# Altium project HW_Z-BAND_SMART_AMP_R1.PrjPcb (part 4 of 4)

## Sheet 10_RF_2.SchDoc: =TitleParameter
size A2; Date: 6/12/2026; ApprovedBy: U.KAYACIK; CheckedBy: E. CAGLAV; DrawnBy: E. CAGLAV; Revision: R1; SheetNumber: 12; SheetTotal: 12
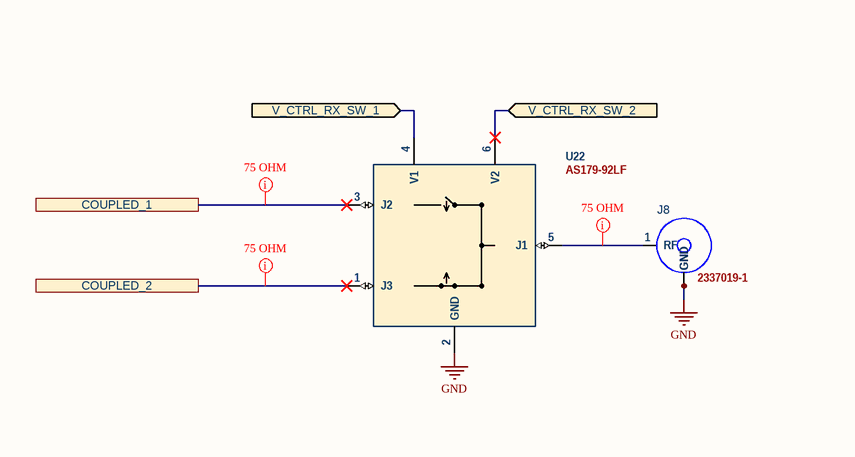
[diagram p11: 10_RF_2.SchDoc, left]
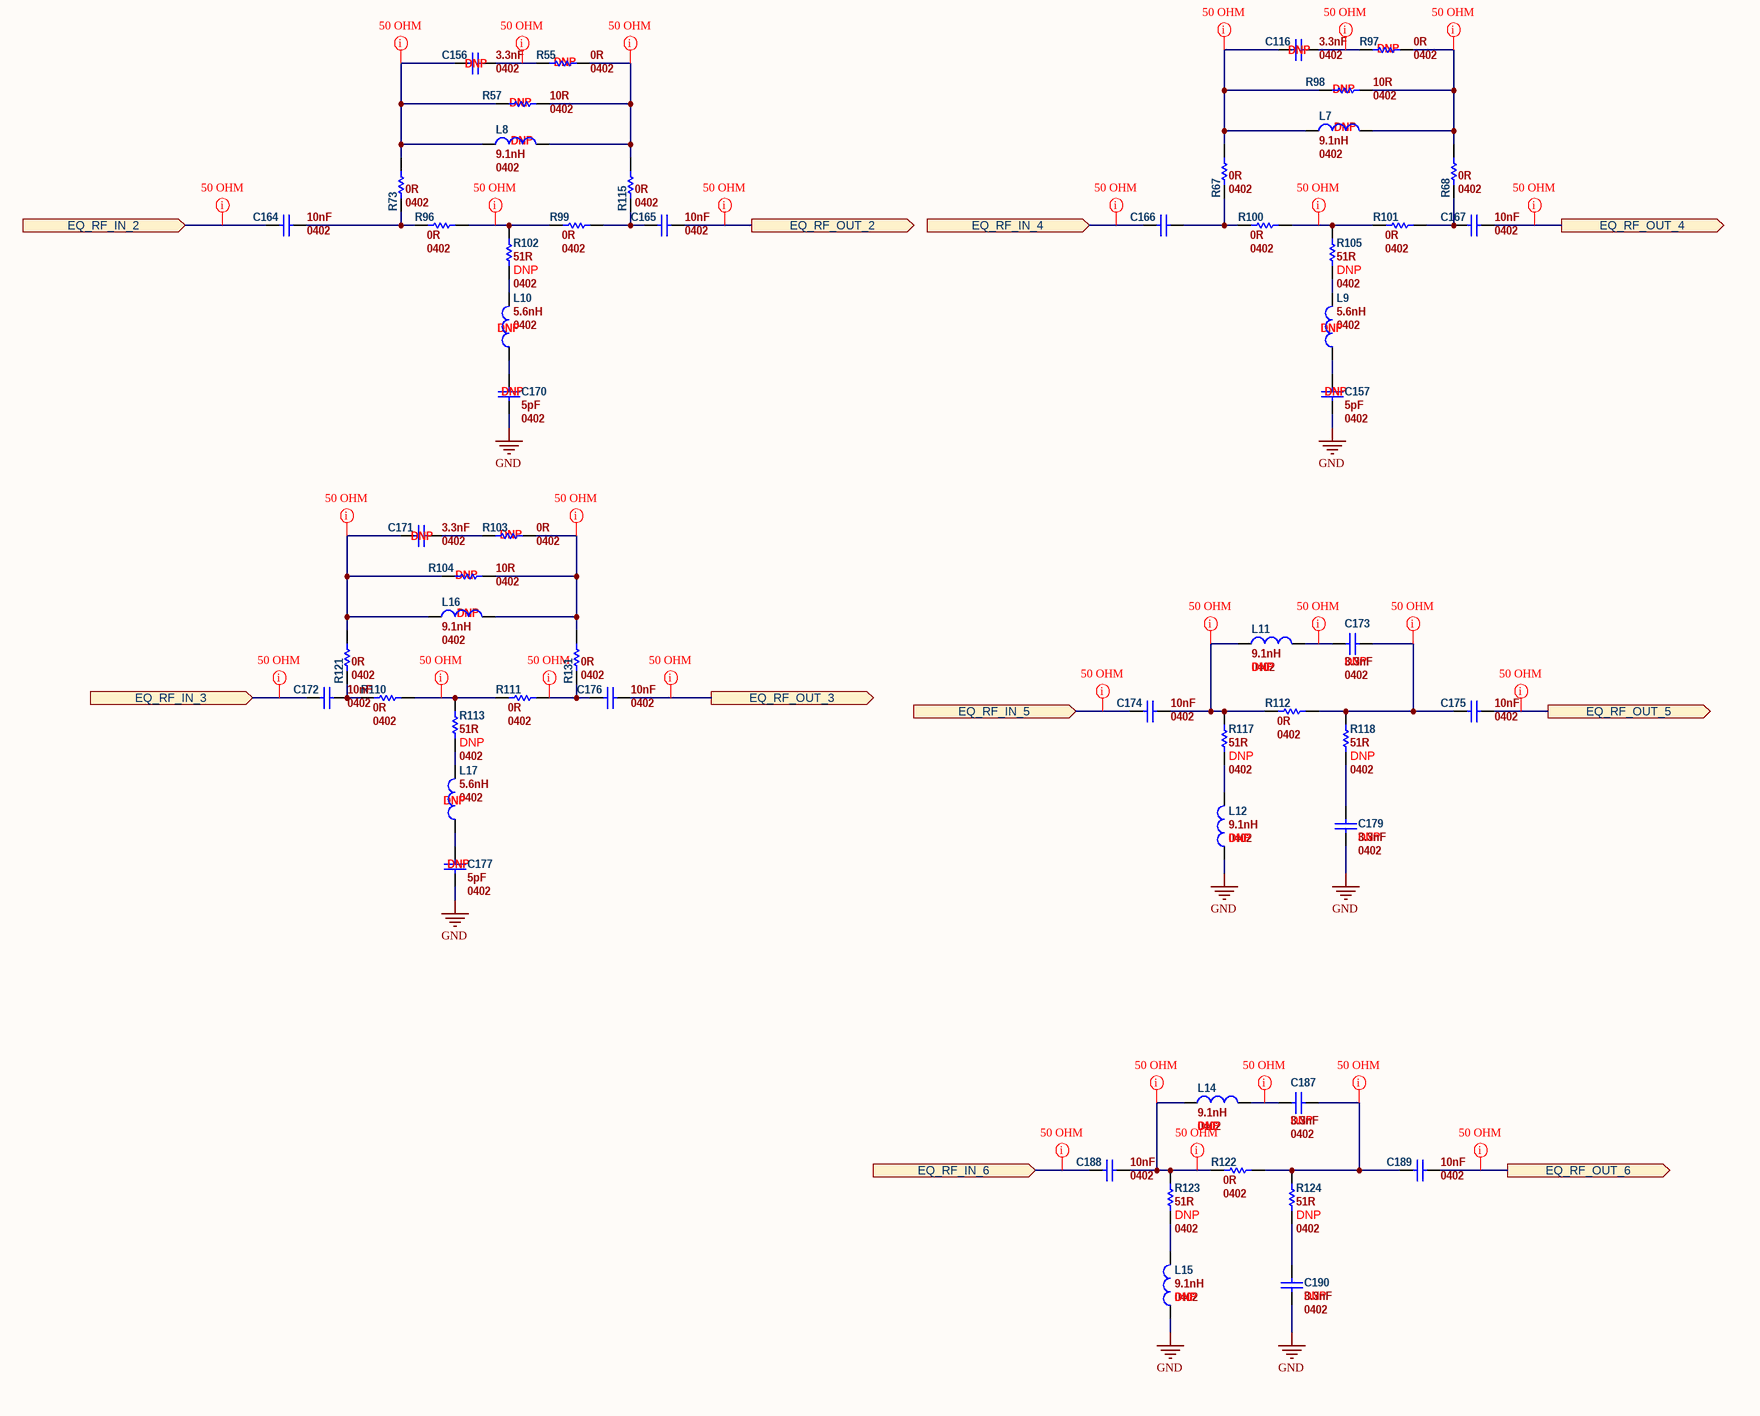
[diagram p12: 10_RF_2.SchDoc, right]

### Parts
C116  value 3.3nF  Assembly: DNP  Package: 0402  [CAP_0402_N]  (hidden comment: C 0402 50V X7R - 3.3nF)
C156  value 3.3nF  Assembly: DNP  Package: 0402  [CAP_0402_N]  (hidden comment: C 0402 50V X7R - 3.3nF)
C157  value 5pF  Assembly: DNP  Package: 0402  [CAP_0402_N]  (hidden comment: C 0402 50V C0G/NP0 - 5pF)
C164  value 10nF  Package: 0402  [CAP_0402_N]  (hidden comment: C 0402 50V X7R - 10nF)
C165  value 10nF  Package: 0402  [CAP_0402_N]  (hidden comment: C 0402 50V X7R - 10nF)
C166  C 0402 50V X7R - 10nF  [CAP_0402_N]  (value not drawn)
C167  value 10nF  Package: 0402  [CAP_0402_N]  (hidden comment: C 0402 50V X7R - 10nF)
C170  value 5pF  Assembly: DNP  Package: 0402  [CAP_0402_N]  (hidden comment: C 0402 50V C0G/NP0 - 5pF)
C171  value 3.3nF  Assembly: DNP  Package: 0402  [CAP_0402_N]  (hidden comment: C 0402 50V X7R - 3.3nF)
C172  value 10nF  Package: 0402  [CAP_0402_N]  (hidden comment: C 0402 50V X7R - 10nF)
C173  value 3.3nF  Assembly: DNP  Package: 0402  [CAP_0402_N]  (hidden comment: C 0402 50V X7R - 3.3nF)
C174  value 10nF  Package: 0402  [CAP_0402_N]  (hidden comment: C 0402 50V X7R - 10nF)
C175  value 10nF  Package: 0402  [CAP_0402_N]  (hidden comment: C 0402 50V X7R - 10nF)
C176  value 10nF  Package: 0402  [CAP_0402_N]  (hidden comment: C 0402 50V X7R - 10nF)
C177  value 5pF  Assembly: DNP  Package: 0402  [CAP_0402_N]  (hidden comment: C 0402 50V C0G/NP0 - 5pF)
C179  value 3.3nF  Assembly: DNP  Package: 0402  [CAP_0402_N]  (hidden comment: C 0402 50V X7R - 3.3nF)
C187  value 3.3nF  Assembly: DNP  Package: 0402  [CAP_0402_N]  (hidden comment: C 0402 50V X7R - 3.3nF)
C188  value 10nF  Package: 0402  [CAP_0402_N]  (hidden comment: C 0402 50V X7R - 10nF)
C189  value 10nF  Package: 0402  [CAP_0402_N]  (hidden comment: C 0402 50V X7R - 10nF)
C190  value 3.3nF  Assembly: DNP  Package: 0402  [CAP_0402_N]  (hidden comment: C 0402 50V X7R - 3.3nF)
J8  2337019-1  [2337019-1]
L7  value 9.1nH  Package: 0402  Assembly: DNP  [IND_0402_N]  (hidden comment: L 0402 500mA - 9.1nH)
L8  value 9.1nH  Package: 0402  Assembly: DNP  [IND_0402_N]  (hidden comment: L 0402 500mA - 9.1nH)
L9  value 5.6nH  Package: 0402  Assembly: DNP  [IND_0402_N]  (hidden comment: L 0402 650mA - 5.6nH)
L10  value 5.6nH  Package: 0402  Assembly: DNP  [IND_0402_N]  (hidden comment: L 0402 650mA - 5.6nH)
L11  value 9.1nH  Package: 0402  Assembly: DNP  [IND_0402_N]  (hidden comment: L 0402 500mA - 9.1nH)
L12  value 9.1nH  Package: 0402  Assembly: DNP  [IND_0402_N]  (hidden comment: L 0402 500mA - 9.1nH)
L14  value 9.1nH  Package: 0402  Assembly: DNP  [IND_0402_N]  (hidden comment: L 0402 500mA - 9.1nH)
L15  value 9.1nH  Package: 0402  Assembly: DNP  [IND_0402_N]  (hidden comment: L 0402 500mA - 9.1nH)
L16  value 9.1nH  Package: 0402  Assembly: DNP  [IND_0402_N]  (hidden comment: L 0402 500mA - 9.1nH)
L17  value 5.6nH  Package: 0402  Assembly: DNP  [IND_0402_N]  (hidden comment: L 0402 650mA - 5.6nH)
R55  value 0R  Assembly: DNP  Package: 0402  [RES_0402_N]  (hidden comment: R 0402 1/10W - 0R)
R57  value 10R  Assembly: DNP  Package: 0402  [RES_0402_N]  (hidden comment: R 0402 1/10W 1% - 10R)
R67  value 0R  Package: 0402  [RES_0402_N]  (hidden comment: R 0402 1/10W - 0R)
R68  value 0R  Package: 0402  [RES_0402_N]  (hidden comment: R 0402 1/10W - 0R)
R73  value 0R  Package: 0402  [RES_0402_N]  (hidden comment: R 0402 1/10W - 0R)
R96  value 0R  Package: 0402  [RES_0402_N]  (hidden comment: R 0402 1/10W - 0R)
R97  value 0R  Assembly: DNP  Package: 0402  [RES_0402_N]  (hidden comment: R 0402 1/10W - 0R)
R98  value 10R  Assembly: DNP  Package: 0402  [RES_0402_N]  (hidden comment: R 0402 1/10W 1% - 10R)
R99  value 0R  Package: 0402  [RES_0402_N]  (hidden comment: R 0402 1/10W - 0R)
R100  value 0R  Package: 0402  [RES_0402_N]  (hidden comment: R 0402 1/10W - 0R)
R101  value 0R  Package: 0402  [RES_0402_N]  (hidden comment: R 0402 1/10W - 0R)
R102  value 51R  Assembly: DNP  Package: 0402  [RES_0402_N]  (hidden comment: R 0402 1/10W 1% - 51R)
R103  value 0R  Assembly: DNP  Package: 0402  [RES_0402_N]  (hidden comment: R 0402 1/10W - 0R)
R104  value 10R  Assembly: DNP  Package: 0402  [RES_0402_N]  (hidden comment: R 0402 1/10W 1% - 10R)
R105  value 51R  Assembly: DNP  Package: 0402  [RES_0402_N]  (hidden comment: R 0402 1/10W 1% - 51R)
R110  value 0R  Package: 0402  [RES_0402_N]  (hidden comment: R 0402 1/10W - 0R)
R111  value 0R  Package: 0402  [RES_0402_N]  (hidden comment: R 0402 1/10W - 0R)
R112  value 0R  Package: 0402  [RES_0402_N]  (hidden comment: R 0402 1/10W - 0R)
R113  value 51R  Assembly: DNP  Package: 0402  [RES_0402_N]  (hidden comment: R 0402 1/10W 1% - 51R)
R115  value 0R  Package: 0402  [RES_0402_N]  (hidden comment: R 0402 1/10W - 0R)
R117  value 51R  Assembly: DNP  Package: 0402  [RES_0402_N]  (hidden comment: R 0402 1/10W 1% - 51R)
R118  value 51R  Assembly: DNP  Package: 0402  [RES_0402_N]  (hidden comment: R 0402 1/10W 1% - 51R)
R121  value 0R  Package: 0402  [RES_0402_N]  (hidden comment: R 0402 1/10W - 0R)
R122  value 0R  Package: 0402  [RES_0402_N]  (hidden comment: R 0402 1/10W - 0R)
R123  value 51R  Assembly: DNP  Package: 0402  [RES_0402_N]  (hidden comment: R 0402 1/10W 1% - 51R)
R124  value 51R  Assembly: DNP  Package: 0402  [RES_0402_N]  (hidden comment: R 0402 1/10W 1% - 51R)
R131  value 0R  Package: 0402  [RES_0402_N]  (hidden comment: R 0402 1/10W - 0R)
U22  AS179-92LF  [SC70_SOT-363]

### Ports
COUPLED_1, COUPLED_2, EQ_RF_IN_2 (in), EQ_RF_IN_3 (in), EQ_RF_IN_4 (in), EQ_RF_IN_5 (in), EQ_RF_IN_6 (in), EQ_RF_OUT_2 (out), EQ_RF_OUT_3 (out), EQ_RF_OUT_4 (out), EQ_RF_OUT_5 (out), EQ_RF_OUT_6 (out), V_CTRL_RX_SW_1 (in), V_CTRL_RX_SW_2 (in)

### Nets
GND: C157.1 C170.1 C177.1 C179.1 C190.1 J8.G1(GND) J8.G2(GND) L12.1 L15.1 U22.2(GND)
NetC116_1: C116.1 L7.1 R67.2 R98.1
NetC116_2: C116.2 R97.1
NetC156_1: C156.1 L8.1 R57.1 R73.2
NetC156_2: C156.2 R55.1
NetC157_2: C157.2 L9.1
NetC164_1: C164.1 ; port EQ_RF_IN_2
NetC164_2: C164.2 R73.1 R96.1
NetC165_1: C165.1 R99.2 R115.1
NetC165_2: C165.2 ; port EQ_RF_OUT_2
NetC166_1: C166.1 ; port EQ_RF_IN_4
NetC166_2: C166.2 R67.1 R100.1
NetC167_1: C167.1 R68.1 R101.2
NetC167_2: C167.2 ; port EQ_RF_OUT_4
NetC170_2: C170.2 L10.1
NetC171_1: C171.1 L16.1 R104.1 R121.2
NetC171_2: C171.2 R103.1
NetC172_1: C172.1 ; port EQ_RF_IN_3
NetC172_2: C172.2 R110.1 R121.1
NetC173_1: C173.1 C175.1 R112.2 R118.2
NetC173_2: C173.2 L11.2
NetC174_1: C174.1 ; port EQ_RF_IN_5
NetC174_2: C174.2 L11.1 R112.1 R117.2
NetC175_2: C175.2 ; port EQ_RF_OUT_5
NetC176_1: C176.1 R111.2 R131.1
NetC176_2: C176.2 ; port EQ_RF_OUT_3
NetC177_2: C177.2 L17.1
NetC179_2: C179.2 R118.1
NetC187_1: C187.1 C189.1 R122.2 R124.2
NetC187_2: C187.2 L14.2
NetC188_1: C188.1 ; port EQ_RF_IN_6
NetC188_2: C188.2 L14.1 R122.1 R123.2
NetC189_2: C189.2 ; port EQ_RF_OUT_6
NetC190_2: C190.2 R124.1
NetJ8_1: J8.1(RF) U22.5(J1)
NetL7_2: L7.2 R68.2 R97.2 R98.2
NetL8_2: L8.2 R55.2 R57.2 R115.2
NetL9_2: L9.2 R105.1
NetL10_2: L10.2 R102.1
NetL12_2: L12.2 R117.1
NetL15_2: L15.2 R123.1
NetL16_2: L16.2 R103.2 R104.2 R131.2
NetL17_2: L17.2 R113.1
NetR96_2: R96.2 R99.1 R102.2
NetR100_2: R100.2 R101.1 R105.2
NetR110_2: R110.2 R111.1 R113.2
NetU4_26: U22.4(V1) ; port V_CTRL_RX_SW_1
NetU4_27: U22.6(V2) ; port V_CTRL_RX_SW_2
NetU5_1: U22.3(J2) ; port COUPLED_1
NetU19_1: U22.1(J3) ; port COUPLED_2

### Layout directives
net class RF_50_OHM; rule Width Constraint [Pref Impedance = 50.00ohms    Min Impedance = 50.00ohms    Max Impedance = 50.00ohms]: NetC116_1, NetC116_2, NetC156_1, NetC156_2, NetC164_1, NetC165_2, NetC166_1, NetC167_2, NetC171_1, NetC172_1, NetC173_1, NetC173_2, NetC174_1, NetC174_2, NetC175_2, NetC176_1, NetC176_2, NetC187_1, NetC187_2, NetC188_1, NetC188_2, NetC189_2, NetL7_2, NetL8_2, NetL16_2, NetR96_2, NetR100_2, NetR110_2
net class RF_75_OHM; rule Width Constraint [Pref Impedance = 50.00ohms    Min Impedance = 50.00ohms    Max Impedance = 50.00ohms]: NetJ8_1, NetU5_1, NetU19_1

### Notes on the sheet
- Proje/Project:
- Sayfa Adı/Document Name:
- Çizilme Tarihi/Drawing Date
- Son Güncelleme/Last Edit Date
- E. CAGLAV
- Tasarlayan/Designed By
- Kontrol eden/Checked By
- Boyut/Size:
- Sayfa/Sheet:
- Revision:
- A3
- of
- Onaylayan/Approved By
- Varyant/Variant:
- Dil/Language:
- ENG

### Library data of the parts
C116 C156 C171 C173 C179 C187 C190 = C 0402 50V X7R - 3.3nF: CAP CER 3.3nF 50V X7R 0402 ±5%; Manufacturer 1: MURATA ELECTRONICS; Manufacturer Part Number 1: GRM155R71H332JA01D; Location: NA; MSL Level: Level-1; MaxHeight_mm: 0.55; M_Number_of_Pins: 2; Check: Approved; UnitPrice: 0.1; PackageType: SMD; Tolerance: ±5%; ComponentLink2Description: Datasheet; Status: Active; ComponentLink3Description: DigiKey; ComponentLink3URL: https://www.digikey.com/en/products/detail/murata-electronics/GRM155R71H332JA01D/5251319?utm_adgroup=&utm_source=google&utm_medium=cpc&utm_campaign=Pmax_Product_All%20Products&utm_term=&utm_content=&utm_id=go_cmp-18790247214_adg-_ad-__dev-c_ext-_prd-_sig-EAIaIQobChMI-qDC4avGhQMVhkVBAh32KAqJEAAYAiAAEgIqzvD_BwE&gad_source=1&gclid=EAIaIQobChMI-qDC4avGhQMVhkVBAh32KAqJEAAYAiAAEgIqzvD_BwE; M_AmpersPerContact: NA; M_Duty Cycle(%): NA; M_MatingCycle: NA; M_Number_of_Bits(K): NA; M_Number_of_Transistors_Gates_or_Bits: NA; M_OperatingPower(W): NA; M_ProgrammingCycles: NA; M_RatedPower(W): NA; M_RatedVoltage(V): 50V; M_ThermalResistance(θJABC)(°C/W): NA; Supplier 1: Digi-Key; Supplier Part Number 1: 490-10780-2-ND
C157 C170 C177 = C 0402 50V C0G/NP0 - 5pF: CAP CER 5pF 50V C0G/NP0 0402 ±0.1pF; Manufacturer 1: MURATA; Manufacturer Part Number 1: GJM1555C1H5R0BB01D; Location: NA; MSL Level: Level-1; MaxHeight_mm: 0.55; M_Number_of_Pins: 2; M_RatedVoltage(V): 50; Check: Approved; UnitPrice: 0.14; PackageType: SMD; Tolerance: ±0.1pF; ComponentLink2Description: Datasheet; Status: Active; ComponentLink3Description: DigiKey; ComponentLink3URL: https://www.digikey.com/en/products/detail/murata-electronics/GJM1555C1H5R0BB01D/2593016; M_AmpersPerContact: NA; M_Duty Cycle(%): NA; M_MatingCycle: NA; M_Number_of_Bits(K): NA; M_Number_of_Transistors_Gates_or_Bits: NA; M_OperatingPower(W): NA; M_ProgrammingCycles: NA; M_RatedPower(W): NA; M_ThermalResistance(θJABC)(°C/W): NA; Supplier 1: Digi-Key; Supplier Part Number 1: 490-8103-2-ND
C164-C167 C172 C174-C176 C188 C189 = C 0402 50V X7R - 10nF: CAP CER 10nF 50V X7R 0402 ±10%; Manufacturer 1: KEMET; Manufacturer Part Number 1: C0402C103K5RAC7867; Location: NA; MSL Level: Level-1; MaxHeight_mm: 0.55; M_Number_of_Pins: 2; M_RatedVoltage(V): 50; Check: Approved; UnitPrice: 0.1; PackageType: SMD; Tolerance: ±10%; ComponentLink2Description: Datasheet; Status: Active; ComponentLink3Description: DigiKey; ComponentLink3URL: https://www.digikey.com/en/products/detail/kemet/C0402C103K5RAC7867/501968; M_AmpersPerContact: NA; M_Duty Cycle(%): NA; M_ESR(mΩ): NA; M_MatingCycle: NA; M_Number_of_Bits(K): NA; M_Number_of_Transistors_Gates_or_Bits: NA; M_OperatingPower(W): NA; M_ProgrammingCycles: NA; M_RatedPower(W): NA; M_ThermalResistance(θJABC)(°C/W): NA; Supplier 1: Digi-Key; Supplier Part Number 1: 399-C0402C103K5RAC7867TR-ND
J8 = 2337019-1: CONN UMCC(UFL) COAX MALE 50 OHM SMD -40°C~85°C; Manufacturer 1: TE CONNECTIVITY AMP CONNECTORS; Location: NA; MaxHeight_mm: 1.25; Check: Approved; ComponentLink1Description: Digi-Key; ComponentLink1URL: https://www.digikey.com/en/products/detail/te-connectivity-amp-connectors/2337019-1/9974052; Manufacturer Part Number 1: 2337019-1; UnitPrice: 0.19; Status: Active; PackageType: SMD; Supplier 1: Digi-Key; Supplier Part Number 1: A144746TR-ND; Package: 2337019-1; Value: 2337019-1
L7 L8 L11 L12 L14-L16 = L 0402 500mA - 9.1nH: IND 9.1nH 500mA 270mΩ DCR 0402 ±5% -55°C~125°C; Manufacturer 1: MURATA ELECTRONICS; Manufacturer Part Number 1: LQG15HN9N1J02D; Location: NA; MSL Level: Level-1; MaxHeight_mm: 0.5; M_Number_of_Pins: 2; Check: Approved; UnitPrice: 0.1; PackageType: SMD; Tolerance: ±5%; ComponentLink2Description: Datasheet; ComponentLink2URL: D:\SAVRONIK_SVN\Donanım\trunk\ALTIUM\Central Library\Datasheets\Inductor\LQG15HN9N1J02D_Datasheet.pdf; Status: Active; M_AmpersPerContact: NA; M_Duty Cycle(%): NA; M_ESR(mΩ): NA; M_Frequency(MHz): NA; M_MatingCycle: NA; M_Number_of_Bits(K): NA; M_Number_of_Transistors_Gates_or_Bits: NA; M_OperatingVoltage(V): NA; M_ProgrammingCycles: NA; M_RatedPower(W): NA; M_RatedVoltage(V): NA; M_OperatingPower(W): NA; M_ThermalResistance(θJABC)(°C/W): NA; Supplier 1: Digikey; Supplier Part Number 1: 490-6566-6-ND; ComponentLink1Description: Digikey; ComponentLink1URL: https://www.digikey.com/en/products/detail/murata-electronics/LQG15HN9N1J02D/2594215
L9 L10 L17 = L 0402 650mA - 5.6nH: IND 5.6nH 650mA 200mΩ DCR 0402 ±0.3nH -55°C~125°C; Manufacturer 1: MURATA ELECTRONICS; Manufacturer Part Number 1: LQG15HS5N6S02D; Location: NA; MSL Level: Level-1; MaxHeight_mm: 0.6; M_Number_of_Pins: 2; Check: Approved; UnitPrice: 0.1; PackageType: SMD; Tolerance: ±0.3nH; ComponentLink2Description: Datasheet; ComponentLink2URL: D:\SAVRONIK_SVN\Donanım\trunk\ALTIUM\Central Library\Datasheets\Inductor\LQG15HS5N6S02D_Datasheet.pdf; Status: Active; M_AmpersPerContact: NA; M_Duty Cycle(%): NA; M_ESR(mΩ): NA; M_Frequency(MHz): NA; M_MatingCycle: NA; M_Number_of_Bits(K): NA; M_Number_of_Transistors_Gates_or_Bits: NA; M_OperatingVoltage(V): NA; M_ProgrammingCycles: NA; M_RatedPower(W): NA; M_RatedVoltage(V): NA; M_OperatingPower(W): NA; M_ThermalResistance(θJABC)(°C/W): NA; Supplier 1: Digikey; Supplier Part Number 1: 490-2619-2-ND; ComponentLink1Description: Digikey; ComponentLink1URL: https://www.digikey.com/en/products/detail/murata-electronics/LQG15HS5N6S02D/662868?s=N4IgTCBcDaIDIEUDiBGArACQMpoHIDYsAGMAERAF0BfIA
R55 R67 R68 R73 R96 R97 R99-R101 R103 R110-R112 R115 R121 R122 R131 = R 0402 1/10W - 0R: RES 0R 1/10W 0402; Manufacturer 1: PANASONIC ELECTRONIC COMPONENTS; Manufacturer Part Number 1: ERJ-2GE0R00X; Location: NA; MSL Level: Level-1; MaxHeight_mm: 0.4; Check: Approved; ComponentLink1Description: Digi-Key; ComponentLink1URL: https://www.digikey.com/en/products/detail/panasonic-electronic-components/ERJ-2GE0R00X/146727?utm_adgroup=&utm_source=google&utm_medium=cpc&utm_campaign=Pmax_Product_All%20Products&utm_term=&utm_content=&utm_id=go_cmp-18790247214_adg-_ad-__dev-c_ext-_prd-_sig-EAIaIQobChMI6dXOvs-qgwMVM4loCR0TKwG5EAAYASAAEgIbCfD_BwE&gad_source=1&gclid=EAIaIQobChMI6dXOvs-qgwMVM4loCR0TKwG5EAAYASAAEgIbCfD_BwE; UnitPrice: 0.1; PackageType: SMD; Status: Active; ComponentLink2Description: Datasheet; Supplier 1: Digikey; Supplier Part Number 1: P0.0JTR-ND
R57 R98 R104 = R 0402 1/10W 1% - 10R: RES 10R 1/10W 0402 1%; Manufacturer 1: PANASONIC ELECTRONIC COMPONENTS; Manufacturer Part Number 1: ERJ-2RKF10R0X; Location: NA; MSL Level: Level-1; MaxHeight_mm: 0.4; Check: Approved; ComponentLink1Description: Digi-Key; ComponentLink1URL: https://www.digikey.com/en/products/detail/panasonic-electronic-components/erj-2rkf10r0x/192072; UnitPrice: 0.1; PackageType: SMD; Tolerance: ±1%; ComponentLink2Description: Datasheet; Status: Active; Supplier 1: Digikey; Supplier Part Number 1: P10.0LTR-ND
R102 R105 R113 R117 R118 R123 R124 = R 0402 1/10W 1% - 51R: RES 51R 1/10W 0402 1%; Manufacturer 1: KOA SPEER ELECTRONICS, INC.; Manufacturer Part Number 1: RK73H1ETTP51R0F; Location: NA; MSL Level: Level-1; MaxHeight_mm: 0.4; Check: Approved; M_Number_of_Pins: 2; M_RatedPower(W): 0.1; UnitPrice: 0.1; PackageType: SMD; Tolerance: ±1%; Status: Active; M_AmpersPerContact: NA; M_Duty Cycle(%): NA; M_ESR(mΩ): NA; M_Frequency(MHz): NA; M_MatingCycle: NA; M_Number_of_Bits(K): NA; M_Number_of_Transistors_Gates_or_Bits: NA; M_OperatingVoltage(V): NA; M_ProgrammingCycles: NA; M_RatedVoltage(V): NA; M_ThermalResistance(θJABC)(°C/W): NA; Supplier 1: Digikey; Supplier Part Number 1: 2019-RK73H1ETTP51R0FTR-ND
U22 = AS179-92LF: IC RF SWITCH SP2T 0.02-4GHZ SC-70 -40°C~85°C; Manufacturer 1: SKYWORKS SOLUTIONS; H-Stock#: NA; MSL Level: Level-1; MaxHeight_mm: 1; M_Number_of_Pins: 6; Check: Approved; ComponentLink1Description: Digi-Key; ComponentLink1URL: https://www.digikey.com/en/products/detail/skyworks-solutions-inc/AS179-92LF/2052013; Location: NA; Manufacturer Part Number 1: AS179-92LF; UnitPrice: 0.84; Status: Active; PackageType: SMD; ComponentLink2Description: Datasheet; ComponentLink2URL: D:\IFF\IFF_Library\Datasheets\IC\AS179-92LF_Datasheet.pdf; Package: SC-70; M_AmpersPerContact: NA; M_Duty Cycle(%): NA; M_ESR(mΩ): NA; M_Frequency(MHz): NA; M_MatingCycle: NA; M_Number_of_Bits(K): NA; M_Number_of_Transistors_Gates_or_Bits: NA; M_ProgrammingCycles: NA; Supplier 1: Digi-Key; Supplier Part Number 1: 863-1003-2-ND; Value: AS179-92LF

## Sheet 11_SCREEN.SchDoc: =TitleParameter
size A3; Date: 6/12/2026; ApprovedBy: U.KAYACIK; CheckedBy: E. CAGLAV; DrawnBy: E. CAGLAV; Organization: ASISGUARD; Address1: Kemalpasa, Kemalpasa Cd. No:290 D:292H, 35060 Bornova/Izmir/Turkey; Revision: R1; SheetNumber: 12; SheetTotal: 12
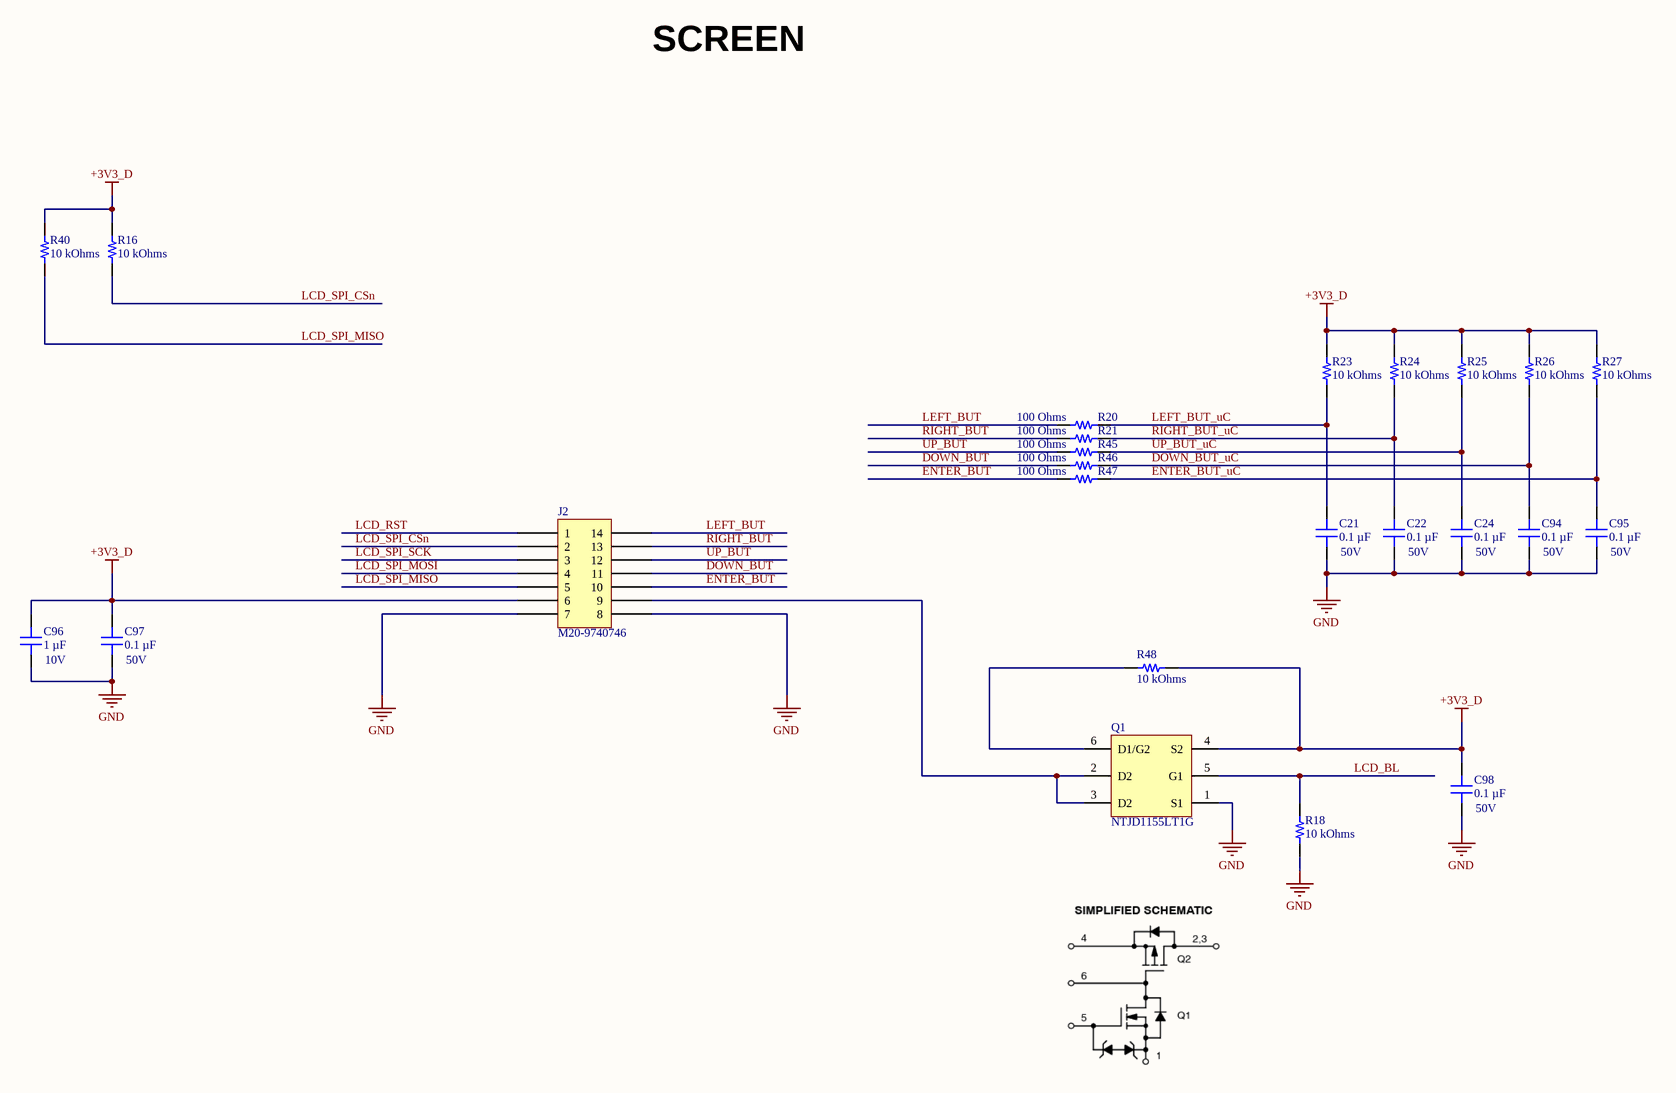
[diagram p13: 11_SCREEN.SchDoc]

### Parts
C21  Voltage - Rated: 50V  [CAP 0402_1005]  (hidden comment: 0.1 µF)
C22  Voltage - Rated: 50V  [CAP 0402_1005]  (hidden comment: 0.1 µF)
C24  Voltage - Rated: 50V  [CAP 0402_1005]  (hidden comment: 0.1 µF)
C94  Voltage - Rated: 50V  [CAP 0402_1005]  (hidden comment: 0.1 µF)
C95  Voltage - Rated: 50V  [CAP 0402_1005]  (hidden comment: 0.1 µF)
C96  Voltage - Rated: 10V  [CAP 0402_1005]  (hidden comment: 1 µF)
C97  Voltage - Rated: 50V  [CAP 0402_1005]  (hidden comment: 0.1 µF)
C98  Voltage - Rated: 50V  [CAP 0402_1005]  (hidden comment: 0.1 µF)
J2  M20-9740746  [HARWIN M20-9740745]
Q1  NTJD1155LT1G  [ONSC-SC70-6-419B-02_W_V]
R16  10 kOhms  [RES 0402_1005]
R18  10 kOhms  [RES 0402_1005]
R20  100 Ohms  [RES 0402_1005]
R21  100 Ohms  [RES 0402_1005]
R23  10 kOhms  [RES 0402_1005]
R24  10 kOhms  [RES 0402_1005]
R25  10 kOhms  [RES 0402_1005]
R26  10 kOhms  [RES 0402_1005]
R27  10 kOhms  [RES 0402_1005]
R40  10 kOhms  [RES 0402_1005]
R45  100 Ohms  [RES 0402_1005]
R46  100 Ohms  [RES 0402_1005]
R47  100 Ohms  [RES 0402_1005]
R48  10 kOhms  [RES 0402_1005]

### Nets
+3V3_D: C96.1 C97.2 C98.2 J2.6 Q1.4(S2) R16.2 R23.2 R24.2 R25.2 R26.2 R27.2 R40.2 R48.1
GND: C21.1 C22.1 C24.1 C94.1 C95.1 C96.2 C97.1 C98.1 J2.7 J2.8 Q1.1(S1) R18.1
DOWN_BUT: J2.11 R46.1
DOWN_BUT_uC: C94.2 R26.1 R46.2
ENTER_BUT: J2.10 R47.1
ENTER_BUT_uC: C95.2 R27.1 R47.2
LCD_BL: Q1.5(G1) R18.2
LCD_RST: J2.1
LCD_SPI_CSn: J2.2 R16.1
LCD_SPI_MISO: J2.5 R40.1
LCD_SPI_MOSI: J2.4
LCD_SPI_SCK: J2.3
LEFT_BUT: J2.14 R20.1
LEFT_BUT_uC: C21.2 R20.2 R23.1
RIGHT_BUT: J2.13 R21.1
RIGHT_BUT_uC: C22.2 R21.2 R24.1
UP_BUT: J2.12 R45.1
UP_BUT_uC: C24.2 R25.1 R45.2
NetJ2_9: J2.9 Q1.2(D2) Q1.3(D2)
NetQ1_6: Q1.6(D1/G2) R48.2

### Notes on the sheet
- SCREEN
- Proje/Project:
- Sayfa Adı/Document Name:
- Çizilme Tarihi/Drawing Date
- E. CAGLAV
- Tasarlayan/Designed By
- Sayfa/Sheet:
- Revision:
- of
- Son Güncelleme/Last Edit Date
- Kontrol eden/Checked By
- Onaylayan/Approved By
- Boyut/Size:
- Varyant/Variant:
- Dil/Language:
- A3
- ENG

### Library data of the parts
C21 C22 C24 C94 C95 C97 C98 = GCM155R71H104KE02J: CAP CER 0.1UF 50V X7R 0402; manufacturer: Murata Electronics; Tolerance: ±10%; Part Number: GCM155R71H104KE02J; Capacitance: 0.1 µF; Applications: Automotive; componentlink1description: Datasheet; componentlink1url: https://search.murata.co.jp/Ceramy/image/img/A01X/G101/ENG/GCM155R71H104KE02-01.pdf; componentlink2description: DigiKey Link; componentlink2url: https://www.digikey.com/en/products/detail/murata-electronics/GCM155R71H104KE02J/4903705; Device Package: 0402 (1005 Metric); lastupdated: 4/6/2026 7:10:30 PM; Lifecycle Status: Active; Minimum Order: 1; Mounting Type: Surface Mount, MLCC; Operating Temperature: -55°C ~ 125°C; Package / Case: 0402 (1005 Metric); packaging: TapeAndReel; partid: 11356; Part Status: Active; price: 0.01; Ratings: AEC-Q200; series: GCM; Size / Dimension: 0.039" L x 0.020" W (1.00mm x 0.50mm); Supplier 1: DigiKey; Supplier Part Number 1: 490-14514-1-ND; Temperature Coefficient: X7R; Thickness (Max): 0.022" (0.55mm); value: 0.1 µF
C96 = GRM155C71A105KE11D: CAP CER 1UF 10V X7S 0402; manufacturer: Murata Electronics; Tolerance: ±10%; Part Number: GRM155C71A105KE11D; Capacitance: 1 µF; Applications: General Purpose; componentlink1description: Datasheet; componentlink1url: https://search.murata.co.jp/Ceramy/image/img/A01X/G101/ENG/GRM155C71A105KE11-01.pdf; componentlink2description: DigiKey Link; componentlink2url: https://www.digikey.com/en/products/detail/murata-electronics/GRM155C71A105KE11D/6606086; Device Package: 0402 (1005 Metric); lastupdated: 4/6/2026 7:11:12 PM; Lifecycle Status: Active; Minimum Order: 1; Mounting Type: Surface Mount, MLCC; Operating Temperature: -55°C ~ 125°C; Package / Case: 0402 (1005 Metric); packaging: TapeAndReel; partid: 1749; Part Status: Active; price: 0.01; series: GRM; Size / Dimension: 0.039" L x 0.020" W (1.00mm x 0.50mm); Supplier 1: DigiKey; Supplier Part Number 1: 490-14457-1-ND; Temperature Coefficient: X7S; Thickness (Max): 0.024" (0.60mm); value: 1 µF
J2 = M20-9740746: CONN HEADER R/A 14POS 2.54MM; Manufacturer: Harwin Inc.; Connector Type: Header, Cuttable; Current Rating (Amps): 3A per Contact; Material Flammability Rating: UL94 V-0; Number of Positions: 14; Number of Positions Loaded: All; Shrouding: Unshrouded; Style: Board to Board or Cable; Part Number: M20-9740746; ComponentLink1Description: Datasheet; ComponentLink1URL: https://cdn.harwin.com/pdfs/M20-974.pdf; ComponentLink2Description: DigiKey Link; ComponentLink2URL: http://digikey.com/product-detail/en/harwin-inc/M20-9740746/M20-9740746-ND/3920721; Contact Finish - Mating: Tin; Contact Finish - Post: Tin; Contact Material: Brass; Contact Shape: Square; Contact Type: Male Pin; Fastening Type: Push-Pull; Insulation Color: Black; Insulation Material: Polyamide (PA6T), Nylon 6T; LastUpdated: 9/21/2022 7:19:11 PM; Lifecycle Status: Active; Minimum Order: 1500; Mounting Type: Through Hole, Right Angle; Number of Rows: 2; Operating Temperature: -40°C ~ 105°C; Packaging: Bulk; PartId: 160; Part Status: Active; Price: 0.24; Series: M20; Supplier 1: DigiKey; Supplier Part Number 1: M20-9740746-ND; Termination: Solder
Q1 = CMP-1058-00640-1: Power MOSFET, 8 V, +/- 1.3 A, High Side Load Switch with Level-Shift, P-Channel, 6-Pin SC70, Pb-Free, Tape and Reel; Manufacturer: On Semiconductor; V(BR)DSS Min (V): 8; VGS(th) Max (V): 1; ID Max (A): 1.3; Channel Polarity: P Channel; Configuration: Dual; ComponentLink1Description: Manufacturer URL; ComponentLink3Description: Package Specification; PackageVersion: Rev. W; Packing: Tape and Reel; PackageReference: SC70-6-419B-02_W; ComponentLink3URL: http://www.onsemi.com/pub_link/Collateral/SMF05C-D.PDF; ComponentLink1URL: http://www.onsemi.com/; PackageDescription: 6-Pin Small Outline Transistor, Body 2 x 1.25 mm, Pitch 0.65 mm; DatasheetVersion: Rev. 5; RoHS: Pb-Free; ComponentLink2Description: Datasheet; ComponentLink2URL: http://www.onsemi.com/pub_link/Collateral/NTJD1155L-D.PDF; PartNumber: NTJD1155LT1G; Package Type: SC-88-6 / SC-70-6 / SOT-363-6; Mounting Technology: Surface Mount
R16 R18 R23-R27 R40 R48 = RC0402FR-0710KL: RES 10K OHM 1% 1/16W 0402; Manufacturer: Yageo; Power (Watts): 0.063W, 1/16W; Temperature Coefficient: ±100ppm/°C; Part Number: RC0402FR-0710KL; Value: 10 kOhms; ComponentLink1Description: Datasheet; ComponentLink1URL: https://www.yageo.com/upload/media/product/productsearch/datasheet/rchip/PYu-RC_Group_51_RoHS_L_10.pdf; ComponentLink2Description: DigiKey Link; ComponentLink2URL: https://www.digikey.com/en/products/detail/yageo/RC0402FR-0710KL/726523; Composition: Thick Film; Device Package: 0402 (1005 Metric); Features: Moisture Resistant; Height - Seated (Max): 0.016" (0.40mm); LastUpdated: 4/6/2026 7:41:07 PM; Lifecycle Status: Active; Minimum Order: 1; Number of Terminations: 2; Operating Temperature: -55°C ~ 155°C; Package / Case: 0402 (1005 Metric); Packaging: CutTape; PartId: 17593; Part Status: Active; Price: 0.01; Resistance: 10 kOhms; Series: RC_L; Size / Dimension: 0.039" L x 0.020" W (1.00mm x 0.50mm); Supplier 1: DigiKey; Supplier Part Number 1: 311-10.0KLRCT-ND; Supplier Device Package: 0402; Tolerance: ±1%
R20 R21 R45-R47 = RT0402FRE07100RL: RES SMD 100 OHM 1% 1/16W 0402; Manufacturer: Yageo; Power (Watts): 0.063W, 1/16W; Temperature Coefficient: ±50ppm/°C; Part Number: RT0402FRE07100RL; Value: 100 Ohms; ComponentLink1Description: Datasheet; ComponentLink1URL: https://www.yageo.com/upload/media/product/productsearch/datasheet/rchip/PYu-RT_1-to-0.01_RoHS_L_11.pdf; ComponentLink2Description: DigiKey Link; ComponentLink2URL: https://www.digikey.com/en/products/detail/yageo/RT0402FRE07100RL/1071699; Composition: Thin Film; Device Package: 0402 (1005 Metric); Height - Seated (Max): 0.014" (0.35mm); LastUpdated: 4/6/2026 7:41:17 PM; Lifecycle Status: Active; Minimum Order: 1; Number of Terminations: 2; Operating Temperature: -55°C ~ 155°C; Package / Case: 0402 (1005 Metric); Packaging: TapeAndReel; PartId: 3193; Part Status: Active; Price: 0.01; Resistance: 100 Ohms; Series: RT; Size / Dimension: 0.039" L x 0.020" W (1.00mm x 0.50mm); Supplier 1: DigiKey; Supplier Part Number 1: YAG3342CT-ND; Supplier Device Package: 0402; Tolerance: ±1%

## Nets that join several sheets
+3V3: 03_POWER (R130.2), 04_8V_GENERATION (R37.2), 05_3V3_GENERATION (11 pins), 06_MCU (R15.2), 07_CONNECTORS (J3.11), 10_RF_1 (15 pins)
+3V3_D: 05_3V3_GENERATION (C103.2 C104.2 FB6.1), 06_MCU (15 pins), 07_CONNECTORS (R33.1 R129.1), 08_EPROM_UNIQUE_SERIAL (C14.2 R9.2 R10.2 U11.4), 11_SCREEN (13 pins)
+5V: 03_POWER (7 pins), 06_MCU (R41.2), 07_CONNECTORS (J3.14)
+8V: 04_8V_GENERATION (7 pins), 06_MCU (R43.2), 10_RF_1 (14 pins)
GND: 03_POWER (21 pins), 04_8V_GENERATION (27 pins), 05_3V3_GENERATION (26 pins), 06_MCU (32 pins), 07_CONNECTORS (15 pins), 08_EPROM_UNIQUE_SERIAL (C14.1 U11.2 U11.5), 09_USB (D1.1 D10.1 J4.3), 10_RF_1 (131 pins), 10_RF_2 (10 pins), 11_SCREEN (12 pins)
MAIN_VDC: 03_POWER (10 pins), 04_8V_GENERATION (5 pins), 05_3V3_GENERATION (6 pins)
3V3_PG: 05_3V3_GENERATION (R35.1 U2.4), 06_MCU (R30.1)
5V_PG: 03_POWER (R130.1 U1.4), 06_MCU (U4.9)
9V_PG: 04_8V_GENERATION (R37.1 U8.4 U9.13), 06_MCU (U4.10)
C0-5_PE4312: 06_MCU (U4.54), 10_RF_1 (R128.2 U10.20)
C1_PE4312: 06_MCU (U4.40), 10_RF_1 (R127.2 U10.19)
C2_PE4312: 06_MCU (U4.51), 10_RF_1 (R126.2 U10.17)
C4_PE4312: 06_MCU (U4.52), 10_RF_1 (R125.2 U10.16)
C8_PE4312: 06_MCU (U4.53), 10_RF_1 (R59.2 U10.15)
C16_PE4312: 06_MCU (U4.2), 10_RF_1 (R58.2 U10.1)
DB_CE: 06_MCU (U4.33), 07_CONNECTORS (J3.9)
DB_LD: 06_MCU (U4.44), 07_CONNECTORS (J3.5)
DB_LE: 06_MCU (U4.30), 07_CONNECTORS (J3.7)
DOWN_BUT_uC: 06_MCU (U4.38), 11_SCREEN (C94.2 R26.1 R46.2)
ENTER_BUT_uC: 06_MCU (U4.39), 11_SCREEN (C95.2 R27.1 R47.2)
EPROM_SCL: 06_MCU (U4.61), 08_EPROM_UNIQUE_SERIAL (R9.1 U11.1)
EPROM_SDA: 06_MCU (U4.62), 08_EPROM_UNIQUE_SERIAL (R10.1 U11.3)
I2C2__SCL: 06_MCU (U4.34), 07_CONNECTORS (J3.6 R129.2)
I2C2_SDA: 06_MCU (U4.35), 07_CONNECTORS (J3.8 R33.2)
L1_1_PE42462: 06_MCU (R120.1 U4.23), 10_RF_1 (R64.2 R78.1)
L2_1_PE42462: 06_MCU (R119.1 U4.22), 10_RF_1 (R65.2 R76.1)
L3_1_PE42462: 06_MCU (R116.1 U4.21), 10_RF_1 (R66.2 R74.1)
LCD_BL: 06_MCU (U4.11), 11_SCREEN (Q1.5 R18.2)
LCD_RST: 06_MCU (U4.58), 11_SCREEN (J2.1)
LCD_SPI_CSn: 06_MCU (U4.50), 11_SCREEN (J2.2 R16.1)
LCD_SPI_MISO: 06_MCU (U4.56), 11_SCREEN (J2.5 R40.1)
LCD_SPI_MOSI: 06_MCU (U4.57), 11_SCREEN (J2.4)
LCD_SPI_SCK: 06_MCU (U4.55), 11_SCREEN (J2.3)
LEFT_BUT_uC: 06_MCU (U4.24), 11_SCREEN (C21.2 R20.2 R23.1)
NetC164_1: 10_RF_1 (U13.2), 10_RF_2 (C164.1)
NetC165_2: 10_RF_1 (U14.17), 10_RF_2 (C165.2)
NetC166_1: 10_RF_1 (U13.15), 10_RF_2 (C166.1)
NetC167_2: 10_RF_1 (U14.4), 10_RF_2 (C167.2)
NetC172_1: 10_RF_1 (U13.4), 10_RF_2 (C172.1)
NetC174_1: 10_RF_1 (U13.17), 10_RF_2 (C174.1)
NetC175_2: 10_RF_1 (U14.2), 10_RF_2 (C175.2)
NetC176_2: 10_RF_1 (U14.15), 10_RF_2 (C176.2)
NetC188_1: 10_RF_1 (U13.19), 10_RF_2 (C188.1)
NetC189_2: 10_RF_1 (U14.24), 10_RF_2 (C189.2)
NetR53_1: 06_MCU (U4.28), 10_RF_1 (R53.1)
NetR69_2: 06_MCU (R116.2), 10_RF_1 (R69.2 R75.2)
NetR70_2: 06_MCU (R119.2), 10_RF_1 (R70.2 R77.2)
NetR71_2: 06_MCU (R120.2), 10_RF_1 (R71.2 R79.2)
NetU4_26: 06_MCU (U4.26), 10_RF_2 (U22.4)
NetU4_27: 06_MCU (U4.27), 10_RF_2 (U22.6)
NetU5_1: 10_RF_1 (U5.1), 10_RF_2 (U22.3)
NetU19_1: 10_RF_1 (U19.1), 10_RF_2 (U22.1)
PD_OUTADJ: 06_MCU (U4.41), 07_CONNECTORS (J3.4)
RF_PWR_EN: 03_POWER (R3.2 U1.3), 04_8V_GENERATION (R39.2 U8.3), 06_MCU (U4.8)
RIGHT_BUT_uC: 06_MCU (U4.25), 11_SCREEN (C22.2 R21.2 R24.1)
SPI2_MOSI: 06_MCU (U4.36), 07_CONNECTORS (J3.2)
SPI2_SCLK: 06_MCU (U4.29), 07_CONNECTORS (J3.1)
UART1_RX: 06_MCU (U4.43), 09_USB (D1.2 J4.1)
UART1_TX: 06_MCU (U4.42), 09_USB (D10.2 J4.2)
UP_BUT_uC: 06_MCU (U4.37), 11_SCREEN (C24.2 R25.1 R45.2)

## Assembly variants
Variant of Z-BAND_SMART_AMP: not fitted R29